# EAGLE schematic dibs (EAGLE 9.5.2)
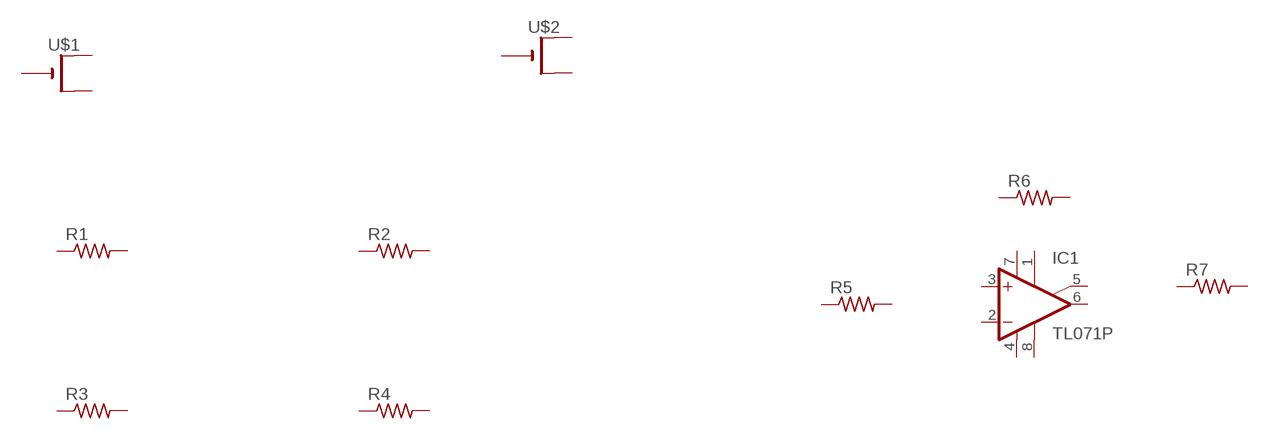
[diagram p0: schematic, sheet 1]

## Parts
IC1  TL071P  [DIL08]
R1  R-US_R0805  [R0805]
R2  R-US_R0805  [R0805]
R3  R-US_R0805  [R0805]
R4  R-US_R0805  [R0805]
R5  R-US_R0805  [R0805]
R6  R-US_R0805  [R0805]
R7  R-US_R0805  [R0805]
U$1  CR2032SMT  [CR2032-SMD]
U$2  CR2032THM  [CR2032-THRU]
Unconnected: IC1.1(ON1) IC1.2(-IN) IC1.3(+IN) IC1.5(ON2) IC1.6(OUT) IC1.8(OPT) R1.1 R1.2 R2.1 R2.2 R3.1 R3.2 R4.1 R4.2 R5.1 R5.2 R6.1 R6.2 R7.1 R7.2 U$1.+$1(+) U$1.+$2(+1) U$1.- U$2.+1(+) U$2.+2(+1) U$2.-

## Power pins joined to a net without a drawn wire
V+: IC1.7(V+)
V-: IC1.4(V-)

## Library data of the parts
IC1 = linear:TL071: OP AMP
R1-R7 = adafruit:R-US_: RESISTOR, American symbol
U$1 U$2 = adafruit:CR2032